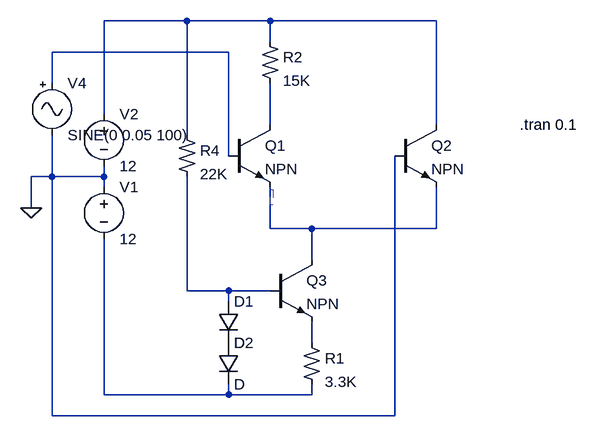
[diagram p0: schematic Draft2.asc]
Draft2.asc, the LTspice schematic file:
Version 4
SHEET 1 880 680
WIRE 272 64 144 64
WIRE 400 64 272 64
WIRE 656 64 400 64
WIRE 400 96 400 64
WIRE 336 112 64 112
WIRE 64 160 64 112
WIRE 144 208 144 64
WIRE 400 224 400 160
WIRE 656 224 656 64
WIRE 272 240 272 64
WIRE 336 272 336 112
WIRE 64 304 64 240
WIRE 64 304 32 304
WIRE 144 304 144 288
WIRE 144 304 64 304
WIRE 144 320 144 304
WIRE 32 352 32 304
WIRE 400 384 400 320
WIRE 464 384 400 384
WIRE 656 384 656 320
WIRE 656 384 464 384
WIRE 464 432 464 384
WIRE 272 480 272 304
WIRE 336 480 272 480
WIRE 400 480 336 480
WIRE 336 496 336 480
WIRE 464 560 464 528
WIRE 144 640 144 400
WIRE 336 640 336 624
WIRE 336 640 144 640
WIRE 464 640 464 624
WIRE 464 640 336 640
WIRE 64 672 64 304
WIRE 592 672 592 272
WIRE 592 672 64 672
FLAG 32 352 0
SYMBOL npn 336 224 R0
SYMATTR InstName Q1
SYMBOL npn 592 224 R0
SYMATTR InstName Q2
SYMBOL npn 400 432 R0
SYMATTR InstName Q3
SYMBOL res2 448 560 R0
SYMATTR InstName R1
SYMATTR Value 3.3K
SYMBOL res2 384 96 R0
SYMATTR InstName R2
SYMATTR Value 15K
SYMBOL diode 320 496 R0
SYMATTR InstName D1
SYMBOL diode 320 560 R0
SYMATTR InstName D2
SYMBOL voltage 144 304 R0
SYMATTR InstName V1
SYMATTR Value 12
SYMBOL res2 256 240 R0
SYMATTR InstName R4
SYMATTR Value 22K
SYMBOL voltage 144 192 R0
SYMATTR InstName V2
SYMATTR Value 12
SYMBOL Misc/signal 64 144 R0
SYMATTR InstName V4
SYMATTR Value SINE(0 0.05 100)
TEXT 784 224 Left 2 !.tran 0.1
RECTANGLE Normal 400 324 404 348 2

The netlist it stands for:
* Draft2.asc
Q1 N003 N002 N004 0 NPN
Q2 N001 0 N004 0 NPN
Q3 N004 N005 N006 0 NPN
R1 N006 N007 3.3K
R2 N001 N003 15K
D1 N005 P001 D
D2 P001 N007 D
V1 0 N007 12
R4 N001 N005 22K
V2 N001 0 12
V4 N002 0 SINE(0 0.05 100)
.model D D
.lib standard.dio
.model NPN NPN
.model PNP PNP
.lib standard.bjt
.tran 0.1
.backanno
.end